# EAGLE design main (EAGLE 9.6.0)
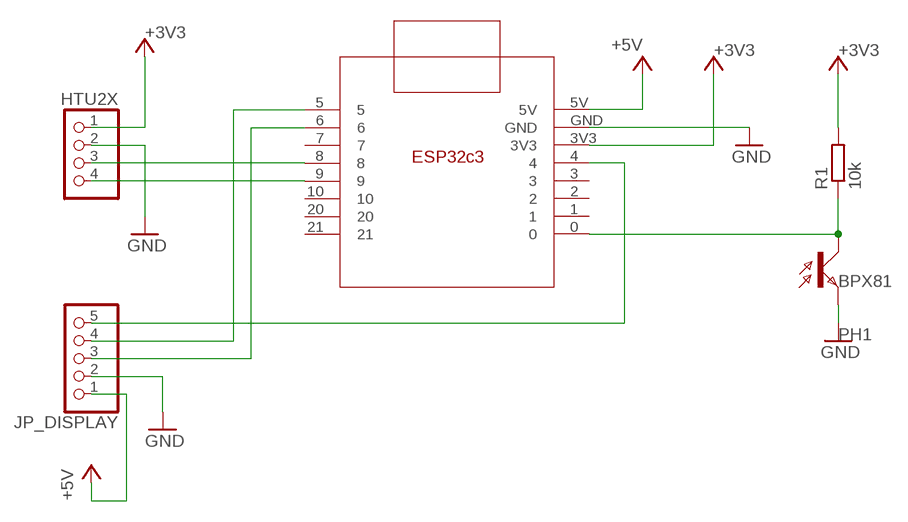
[diagram p0: schematic, sheet 1]

## Parts
HTU2X  PINHD-1X4  [1X04]
JP_DISPLAY  PINHD-1X5  [1X05]
PH1  BPX81  [BPX81]
R1  10k  R-EU_R0805  [R0805]
U$2  ESP32C3SMD  [ESP32C3_SMD]

## Nets
+3V3: HTU2X.1 R1.2 U$2.3V3
+5V: JP_DISPLAY.1 U$2.5V
GND: HTU2X.2 JP_DISPLAY.2 PH1.E U$2.GND
N$1: JP_DISPLAY.3 U$2.6
N$2: PH1.C R1.1 U$2.0
N$4: HTU2X.3 U$2.8
N$5: HTU2X.4 U$2.9
N$6: JP_DISPLAY.4 U$2.5
N$11: JP_DISPLAY.5 U$2.4
Unconnected: U$2.1 U$2.2 U$2.3 U$2.7 U$2.10 U$2.20 U$2.21

## Library data of the parts
HTU2X = pinhead:PINHD-1X4: PIN HEADER
JP_DISPLAY = pinhead:PINHD-1X5: PIN HEADER
PH1 = opto-trans-siemens:BPX81: PHOTO TRANSISTOR; OC_FARNELL: unknown; OC_NEWARK: unknown
R1 = resistor:R-EU_: RESISTOR, European symbol
U$2 = ESP32:ESP32C3

## Board
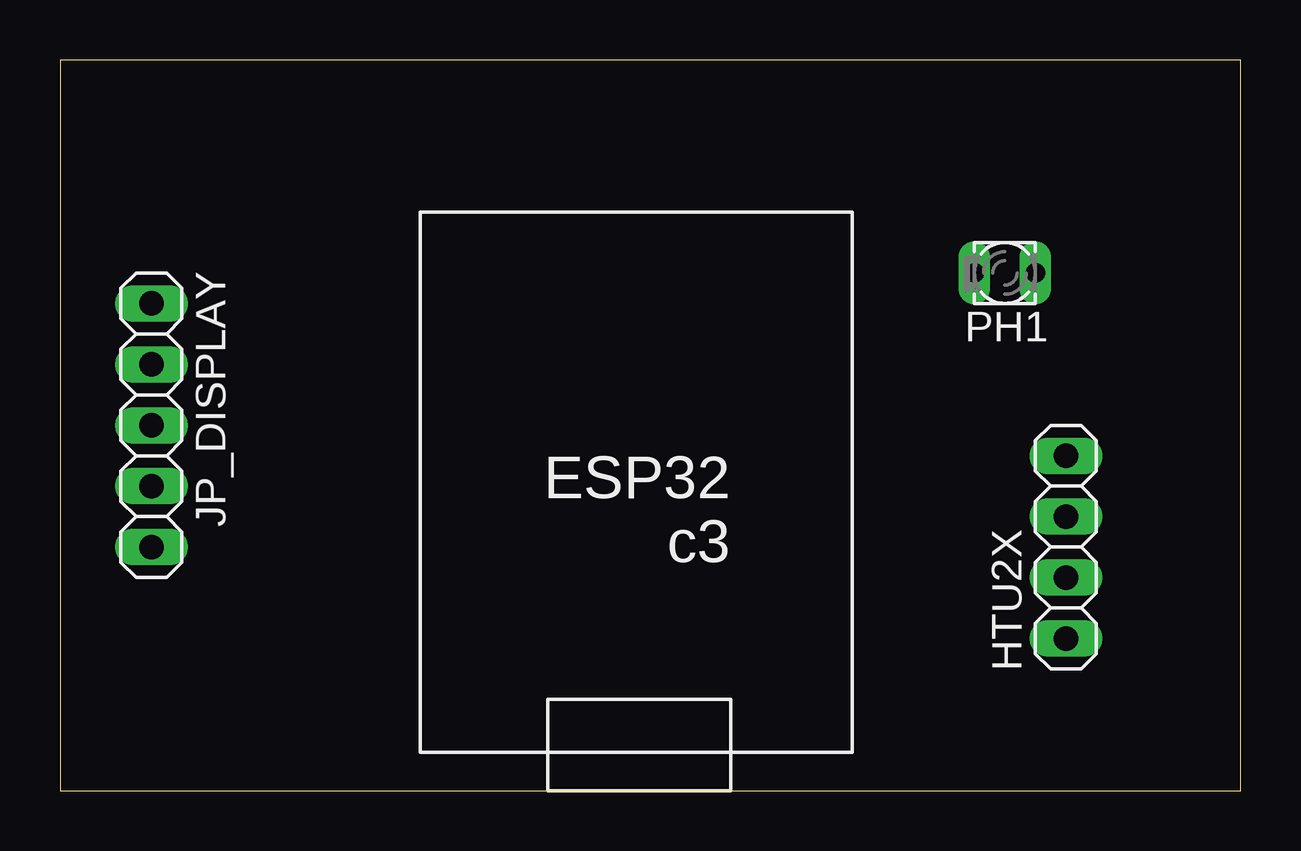
[diagram p1: board, top side]
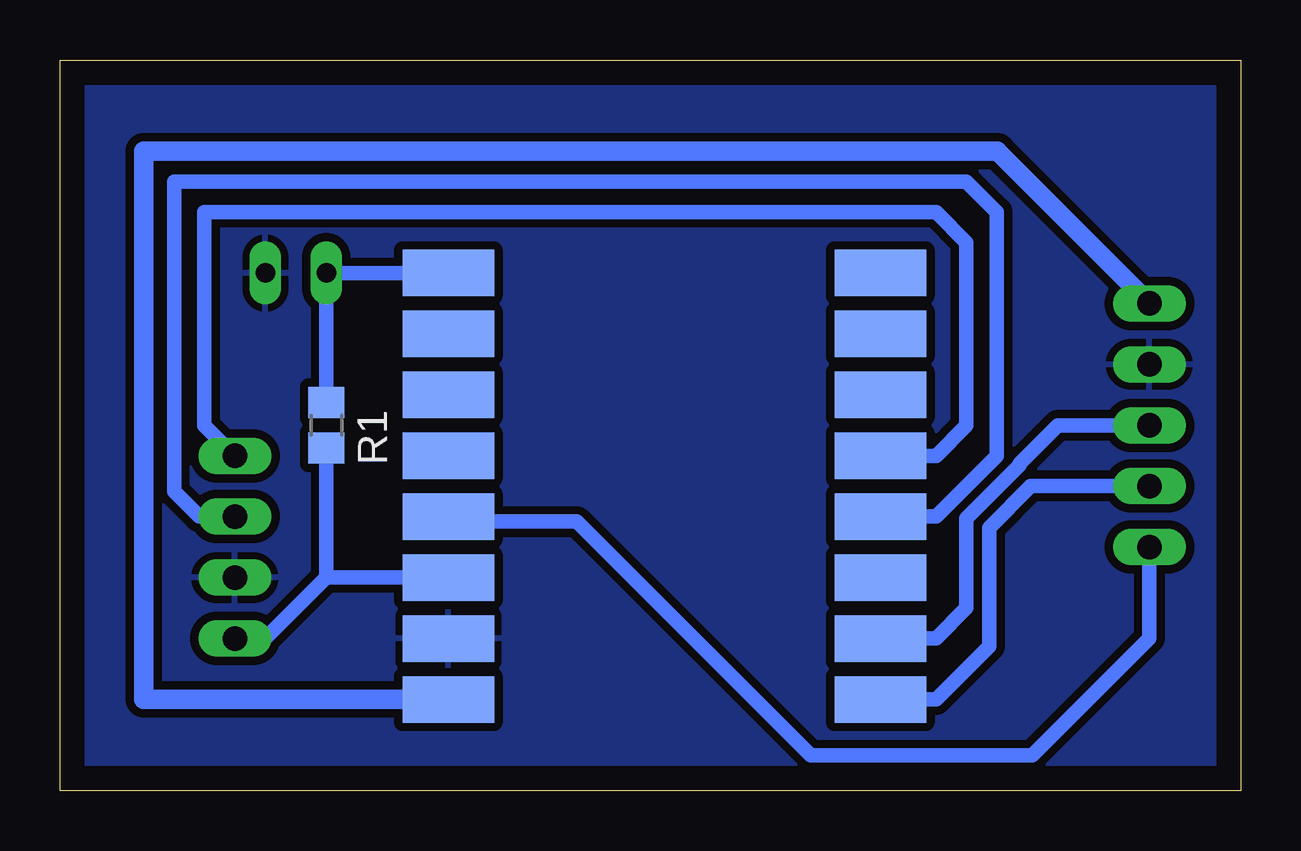
[diagram p2: board, bottom side, seen from below]

Size 49.2 x 30.47 mm. Coordinates in mm from the lower left corner, seen from the top.
Outline: 0,0 49.2,0 49.2,30.47 0,30.47 0,0
Copper layers (1*16): Top 0.035mm / dielectric 1.5mm / Bottom 0.035mm
Design rules "cnc": minimum track width 20mil, minimum drill 0.35mm, track to track 0.35mm, track to pad 0.35mm, pad to pad 0.35mm, via to via 0.35mm, smd to smd 0.35mm, copper to edge 40mil, drill to drill 6mil, minimum pad ring 10mil, minimum via ring 8mil, stop-mask expansion 4mil, vias tented up to drill 0mil, thermal gap 0.3mm

### Footprints (pad centres in the part's own frame; a part is rotated, then mirrored left to right if it is on the bottom)
1X04 = drill 1.016 long: 1 -3.81,0; 2 -1.27,0; 3 1.27,0; 4 3.81,0
1X05 = drill 1.016 long: 1 -5.08,0; 2 -2.54,0; 3 0,0; 4 2.54,0; 5 5.08,0
BPX81 = drill 0.813 long: C 1.27,0; E -1.27,0
R0805 = smd 1.3 x 1.5: 1 -0.95,0; 2 0.95,0
ESP32C3_SMD = smd 3.81 x 1.93 bottom: 0 0,2.54; 1 0,5.08; 2 0,7.62; 3 0,10.16; 3V3 0,15.24; 4 0,12.7; 5 18,20.32; 5V 0,20.32; 6 18,17.78; 7 18,15.24; 8 18,12.7; 9 18,10.16; 10 18,7.62; 20 18,5.08; 21 18,2.54; GND 0,17.78

### Placement (x,y rotation side)
HTU2X  41.91,10.16 90 top
JP_DISPLAY  3.81,15.24 270 top
PH1  39.37,21.59 180 top
R1  38.1,15.24 270 bottom
U$2  33.02,24.13 180 top

### Tracks (layer width: path | path; a pad name or v marks a point on that pad's centre or on a via)
+3V3
  Bottom 0.6: R1.2 38.1,8.89 | HTU2X.1 40.64,6.35 38.1,8.89 | U$2.3V3 38.1,8.89
+5V
  Bottom 0.6: 3.73,20.25 JP_DISPLAY.1 | U$2.5V 34.29,3.81
  Bottom 0.813: 34.29,3.81 45.72,3.81 45.72,26.67 10.15,26.67 3.73,20.25
GND
  pour Bottom: 0,0 0,60.96 67.31,60.96 67.31,0
N$1
  Bottom 0.6: 4.72,15.24 JP_DISPLAY.3 7.62,15.24 9.21,13.65 9.21,13.58 11.43,11.36 11.43,7.62 12.7,6.35 14.79,6.35 14.92,6.48 | 14.92,6.48 13.48,6.48 | 14.92,6.48 U$2.6
N$2
  Bottom 0.6: U$2.0 PH1.C R1.1
N$4
  Bottom 0.6: HTU2X.3 43.4,11.43 44.45,12.48 44.45,25.4 11.43,25.4 10.16,24.13 10.16,13.97 12.7,11.43 U$2.8
N$5
  Bottom 0.6: U$2.9 12.7,13.97 11.43,15.24 11.43,22.86 12.7,24.13 43.18,24.13 43.18,15.24 HTU2X.4
N$6
  Bottom 0.6: 13.76,3.98 15.02,3.98 U$2.5 12.7,3.81 10.48,6.03 10.48,10.96 8.74,12.7 JP_DISPLAY.4
N$11
  Bottom 0.6: JP_DISPLAY.5 3.81,6.36 8.69,1.48 17.92,1.48 27.67,11.23 32.82,11.23 U$2.4